# Altium schematic sheet HealthSensors.SchDoc
size A
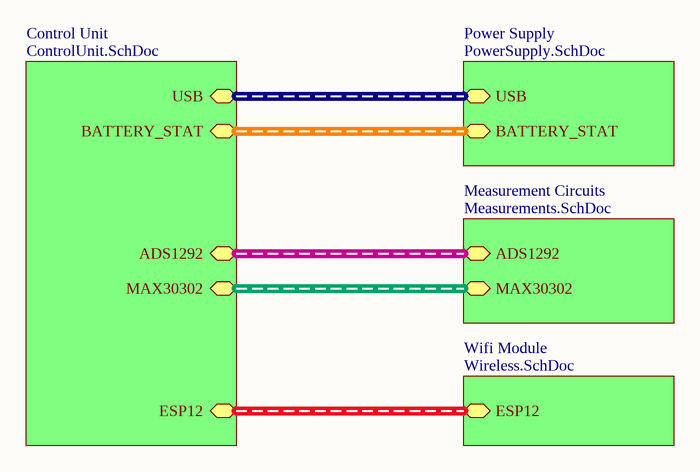
[diagram p0: HealthSensors.SchDoc]

## Sub-sheets
Control Unit = ControlUnit.SchDoc: USB (harness Usb data), BATTERY_STAT (harness Battery info), ADS1292 (harness ADS1292 circuit), ESP12 (harness Wifi connection), MAX30302 (harness MAX30302 circuit)
Measurement Circuits = Measurements.SchDoc: ADS1292 (harness ADS1292 circuit), MAX30302 (harness MAX30302 circuit)
Power Supply = PowerSupply.SchDoc: USB (harness Usb data), BATTERY_STAT (harness Battery info)
Wifi Module = Wireless.SchDoc: ESP12 (harness Wifi connection)

## Buses and harness runs
harness sheet Control Unit/ADS1292 = sheet Measurement Circuits/ADS1292
harness sheet Control Unit/BATTERY_STAT = sheet Power Supply/BATTERY_STAT
harness sheet Control Unit/ESP12 = sheet Wifi Module/ESP12
harness sheet Control Unit/MAX30302 = sheet Measurement Circuits/MAX30302
harness sheet Control Unit/USB = sheet Power Supply/USB